# Altium project FlightController_Bottom.PrjPcb
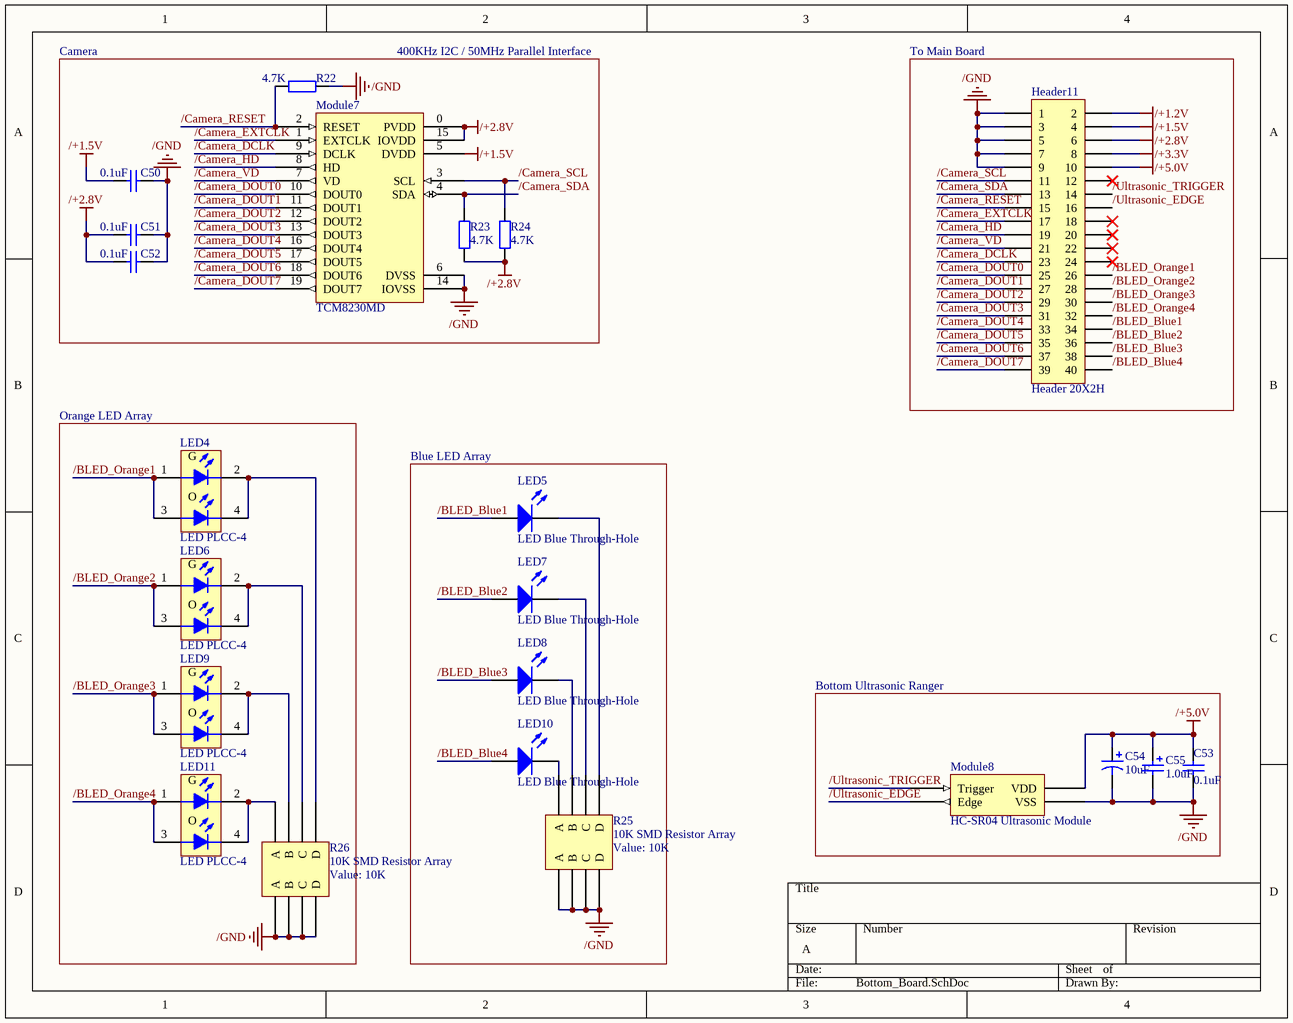
[diagram p0: Bottom_Board.SchDoc]
1 sheet, 22 parts. Net scope: global (net labels, ports and power ports of the same name join across sheets).
Board file: FlightController_Bottom.PcbDoc

## Sheet Bottom_Board.SchDoc
size A; DocumentNumber: 8; SheetNumber: 8; SheetTotal: 8; PageSetup: Record=PageOptions|CenterHorizontal=True|CenterVertical=True|PrintScale=1.07|XCorrection=1.00|YCorrection=1.00|PrintKind=2|BorderSize=5000000|LeftOffset=0|BottomOffset=0|Orientation=2|PaperLength=1000|PaperWidth=1000|Scale=100|PaperSource=7|PrintQuality=-4|MediaType=1|DitherType=10|PaperKind=Letter|PrintScaleMode=1

### Parts
C50  value 0.1uF  [SMD 1206]  (hidden comment: 0.1uF SMD 1206)
C51  value 0.1uF  [SMD 1206]  (hidden comment: 0.1uF SMD 1206)
C52  value 0.1uF  [SMD 1206]  (hidden comment: 0.1uF SMD 1206)
C53  value 0.1uF  [SMD 1206]  (hidden comment: 0.1uF SMD 1206)
C54  value 10uF  [CAPPR2-5x5]  (hidden comment: 10uF Electrolitic)
C55  value 1.0uF  [Capacitor - Tantalum Case A]  (hidden comment: 1.0uF Low-ESR Tantalum CaseA)
Header11  Header 20X2H  [HDR2X20H]
LED4  LED PLCC-4  [PLCC-4 LED]
LED5  LED Blue Through-Hole  [Blue LED]
LED6  LED PLCC-4  [PLCC-4 LED]
LED7  LED Blue Through-Hole  [Blue LED]
LED8  LED Blue Through-Hole  [Blue LED]
LED9  LED PLCC-4  [PLCC-4 LED]
LED10  LED Blue Through-Hole  [Blue LED]
LED11  LED PLCC-4  [PLCC-4 LED]
Module7  TCM8230MD  [TCM8230MD Camera Module]
Module8  HC-SR04 Ultrasonic Module  [HC-SR04 Ultrasonic Ranger]
R22  value 4.7K  [SMD 0805]  (hidden comment: 4.7K SMD 0805)
R23  value 4.7K  [SMD 0805]  (hidden comment: 4.7K SMD 0805)
R24  value 4.7K  [SMD 0805]  (hidden comment: 4.7K SMD 0805)
R25  10K SMD Resistor Array  value 10K  [Resistor Array YC164]
R26  10K SMD Resistor Array  value 10K  [Resistor Array YC164]

### Blocks framed on the sheet
To Main Board: Header11
Orange LED Array: LED4 LED6 LED9 LED11 R26
Blue LED Array: LED5 LED7 LED8 LED10 R25
Bottom Ultrasonic Ranger: C53-C55 Module8

### Nets
/+1.2V: Header11.2
/+1.5V: C50.1 Header11.4 Module7.5(DVDD)
/+2.8V: C51.1 C52.1 Header11.6 Module7.0(PVDD) Module7.15(IOVDD) R23.1 R24.2
/+3.3V: Header11.8
/+5.0V: C53.2 C54.1 C55.1(+) Header11.10 Module8.0(VDD)
/GND: C50.2 C51.2 C52.2 C53.1 C54.2 C55.2(-) Header11.1 Header11.3 Header11.5 Header11.7 Header11.9 Module7.6(DVSS) Module7.14(IOVSS) Module8.3(VSS) R22.1 R25.5(A) R25.6(B) R25.7(C) R25.8(D) R26.5(A) R26.6(B) R26.7(C) R26.8(D)
/BLED_Blue1: Header11.34 LED5.1(A)
/BLED_Blue2: Header11.36 LED7.1(A)
/BLED_Blue3: Header11.38 LED8.1(A)
/BLED_Blue4: Header11.40 LED10.1(A)
/BLED_Orange1: Header11.26 LED4.1(A1) LED4.3(A2)
/BLED_Orange2: Header11.28 LED6.1(A1) LED6.3(A2)
/BLED_Orange3: Header11.30 LED9.1(A1) LED9.3(A2)
/BLED_Orange4: Header11.32 LED11.1(A1) LED11.3(A2)
/Camera_DCLK: Header11.23 Module7.9(DCLK)
/Camera_DOUT0: Header11.25 Module7.10(DOUT0)
/Camera_DOUT1: Header11.27 Module7.11(DOUT1)
/Camera_DOUT2: Header11.29 Module7.12(DOUT2)
/Camera_DOUT3: Header11.31 Module7.13(DOUT3)
/Camera_DOUT4: Header11.33 Module7.16(DOUT4)
/Camera_DOUT5: Header11.35 Module7.17(DOUT5)
/Camera_DOUT6: Header11.37 Module7.18(DOUT6)
/Camera_DOUT7: Header11.39 Module7.19(DOUT7)
/Camera_EXTCLK: Header11.17 Module7.1(EXTCLK)
/Camera_HD: Header11.19 Module7.8(HD)
/Camera_RESET: Header11.15 Module7.2(RESET) R22.2
/Camera_SCL: Header11.11 Module7.3(SCL) R24.1
/Camera_SDA: Header11.13 Module7.4(SDA) R23.2
/Camera_VD: Header11.21 Module7.7(VD)
/Ultrasonic_EDGE: Header11.16 Module8.2(Edge)
/Ultrasonic_TRIGGER: Header11.14 Module8.1(Trigger)
NetLED4_2: LED4.2(K1) LED4.4(K2) R26.4(D)
NetLED5_2: LED5.2(K) R25.4(D)
NetLED6_2: LED6.2(K1) LED6.4(K2) R26.3(C)
NetLED7_2: LED7.2(K) R25.3(C)
NetLED8_2: LED8.2(K) R25.2(B)
NetLED9_2: LED9.2(K1) LED9.4(K2) R26.2(B)
NetLED10_2: LED10.2(K) R25.1(A)
NetLED11_2: LED11.2(K1) LED11.4(K2) R26.1(A)

Not connected (* = marked no-connect by the designer): Header11 12* 18* 20* 22* 24*

### Notes on the sheet
- Camera
- 400KHz I2C / 50MHz Parallel Interface
- (in symbol HSMF-C157) G; O

### Library data of the parts
C50-C53 = Cap: Capacitor
C54 = Cap Pol1: Polarized Capacitor (Radial); Published: 8-Jun-2000; LatestRevisionDate: 17-Jul-2002; LatestRevisionNote: Re-released for DXP Platform.; PackageReference: RB7.6-15; Publisher: Altium Limited; PackageDescription: Polarized Capacitor (Radial); 2 Leads
C55 = SMD_Cap_Tantalum: Tantalum Capacitor - Case A
Header11 = Header 20X2H: Header, 20-Pin, Dual row, Right Angle; LatestRevisionDate: 17-Jul-2002; LatestRevisionNote: Re-released for DXP Platform.; Publisher: Altium Limited
LED4 LED6 LED9 LED11 = HSMF-C157: Surface Mount Chip LED; pin to pad: 1>2 2>1; LuminousIntensity: 2.5mcd (Minimum).; LED_Colour: Orange & Green; PCB_Layout: Complies with manufacturer's recommendation.; Published: 11-Dec-2002; DatasheetVersion: 18-Apr-2002; PackageVersion: 18-Apr-2002; PackageReference: 3.2X2.7X1.1; Publisher: Altium Limited; PackageDescription: SM LED, Bi-Colour; 4 Flat Leads; Body 3.2 x 2.7 x 1.1 mm (LxWxH); ComponentLink1Description: Manufacturer Link; ComponentLink1URL: http://www.avagotech.com/; ComponentLink2Description: Datasheet; ComponentLink2URL: http://cp.literature.agilent.com/litweb/pdf/5988-6268EN.pdf
LED5 LED7 LED8 LED10 = LED0: Typical INFRARED GaAs LED; pin to pad: 1>P 2>N; Published: 8-Jun-2000; LatestRevisionDate: 08-Jul-2005; LatestRevisionNote: Mech Layer 1 removed.; PackageReference: LED-0; Publisher: Altium Limited; PackageDescription: LED; 2 Leads
Module7 = TCM8230MD: Toshiba 640x480 Camera; pin to pad: 0>1 1>2 2>3 3>4 4>5 5>6 6>7 7>8 8>9 9>10 10>11 11>12 12>13 13>14 14>15 15>16 16>17 17>18 18>19 19>20
Module8 = HC-SR04 Ultrasonic Module: pin to pad: 0>1 1>2 2>3 3>4
R22-R24 = Res2: Resistor
R25 R26 = SMD Resistor Array: 4-Count Resistor Array